# EAGLE design Color_music_board_with_mic (EAGLE 9.0.1)
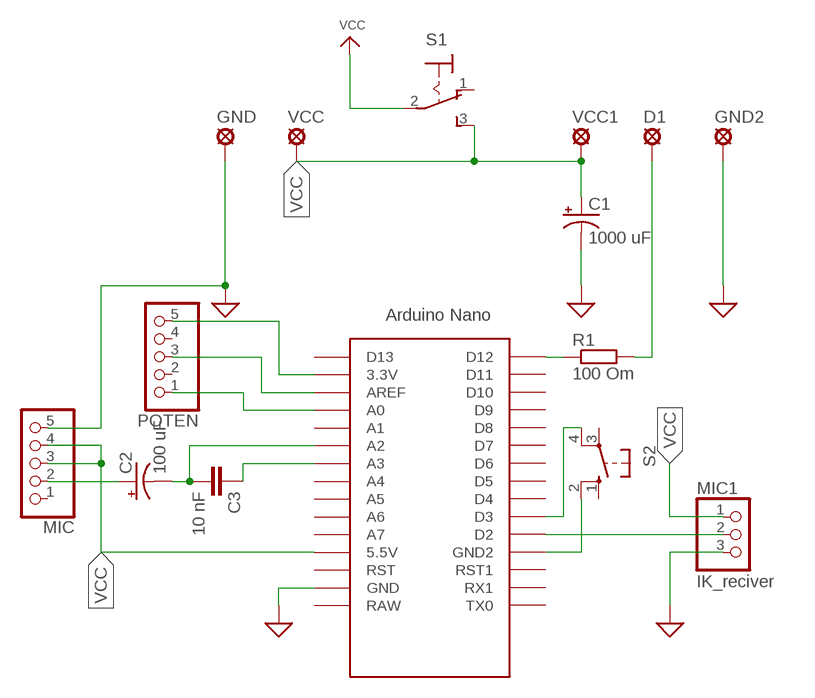
[diagram p0: schematic, sheet 1]

## Parts
C1  1000 uF  CPOL-USTT5D10  [TT5D10]
C2  100 uF  CPOL-USE2.5-6  [E2,5-6]
C3  10 nF  C2.5/2  [C2.5-2]
D1  SE14  [SE14]
GND  SE14  [SE14]
GND2  SE14  [SE14]
MIC  PINHD-1X5  [1X05]
MIC1  IK_reciver  PINHD-1X3  [1X03]
POTEN  PINHD-1X5  [1X05]
R1  100 Om  R-EU_0207/7  [0207/7]
S1  320-916  [320-916]
S2  10-XX  [B3F-10XX]
U$1  NANO  [NANO]
VCC  SE14  [SE14]
VCC1  SE14  [SE14]

## Nets
GND: C1.- GND2.MP GND.MP MIC1.3 MIC.5 U$1.GND ; supply symbol labelled SUP
N$1: D1.MP R1.2
N$2: R1.1 U$1.D12
N$3: C2.+ MIC.2
N$4: MIC1.2 U$1.D2
N$5: C2.- C3.2 U$1.A2
N$6: C3.1 U$1.A3
N$7: POTEN.5 U$1.3.3V
N$8: POTEN.3 U$1.AREF
N$9: POTEN.1 U$1.A0
N$10: S2.2(S1) U$1.GND1(GND2)
N$11: S2.4(P1) U$1.D3
VCC: C1.+ MIC1.1 MIC.3 MIC.4 S1.2(P) S1.3(S) U$1.5V(5.5V) VCC1.MP VCC.MP
Unconnected: MIC.1 POTEN.2 POTEN.4 S1.1(O) S2.1(S) S2.3(P) U$1.A1 U$1.A4 U$1.A5 U$1.A6 U$1.A7 U$1.D4 U$1.D5 U$1.D6 U$1.D7 U$1.D8 U$1.D9 U$1.D10 U$1.D11 U$1.D13 U$1.ICSP1 U$1.ICSP2 U$1.ICSP3 U$1.ICSP4 U$1.ICSP5 U$1.ICSP6 U$1.RAW U$1.RST U$1.RST1 U$1.RX1 U$1.TX0

## Library data of the parts
C1 C2 = rcl:CPOL-US: POLARIZED CAPACITOR, American symbol; SPICEPREFIX: C
C3 = capacitor-wima:C: CAPACITOR naming: grid - package width
D1 GND GND2 VCC VCC1 = solpad:SE14: SOLDER PAD E1553, drill 1,4mm, distributor Buerklin, 07F820
MIC POTEN = pinhead:PINHD-1X5: PIN HEADER
MIC1 = pinhead:PINHD-1X3: PIN HEADER
R1 = resistor:R-EU_: RESISTOR, European symbol
S1 = switch:320-916: TOGGLE SWITCH distributor RS Components
S2 = switch-omron:10-XX: OMRON SWITCH; MPN: B3F-1000; OC_FARNELL: 176432; OC_NEWARK: 36M3542
U$1 = Arduino-clone:NANO: Arduino Nano

## Board
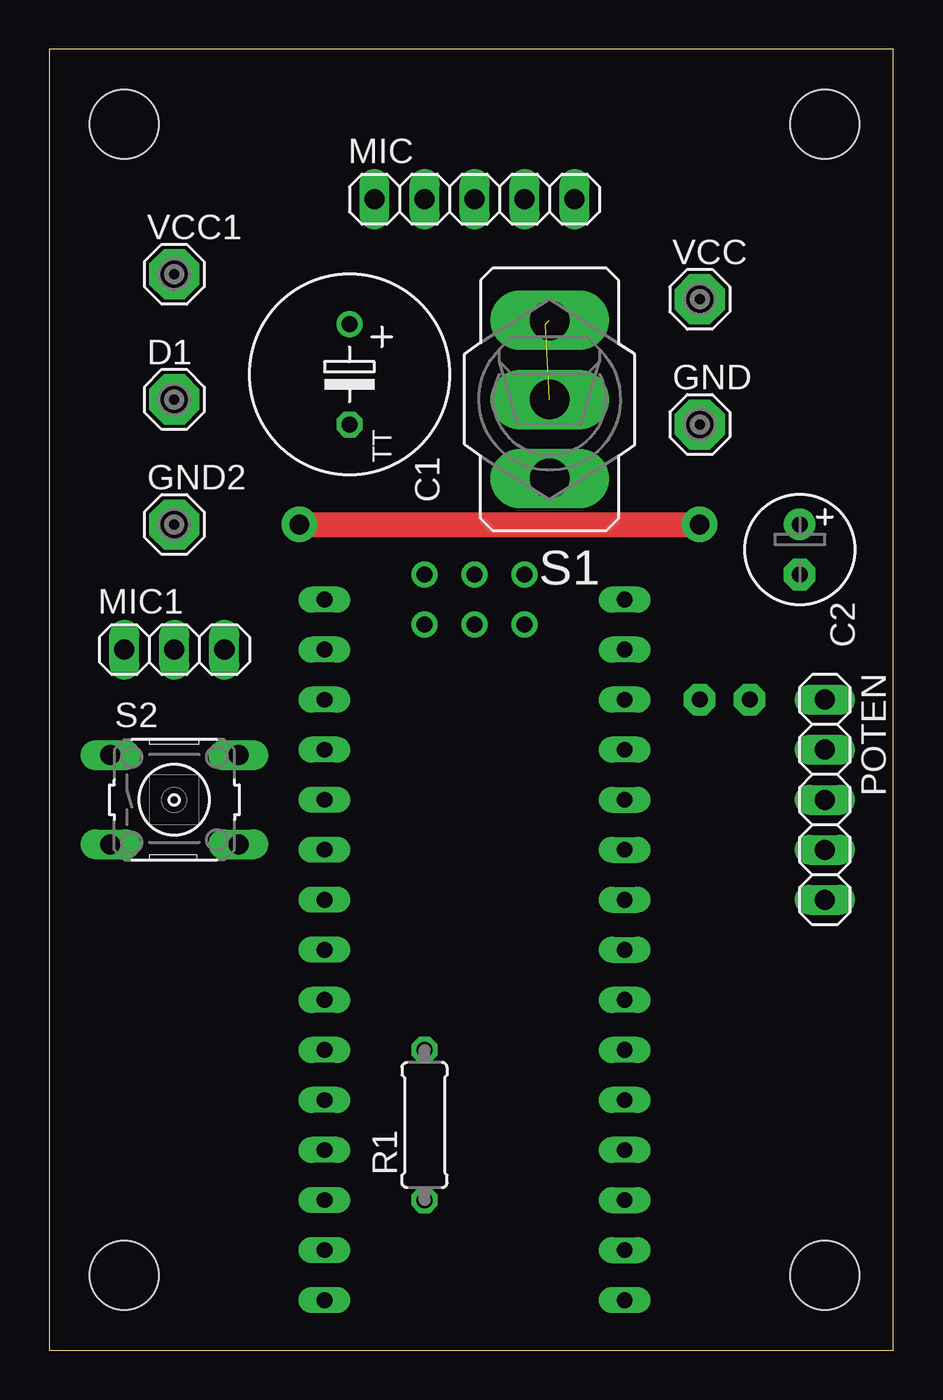
[diagram p1: board, top side]
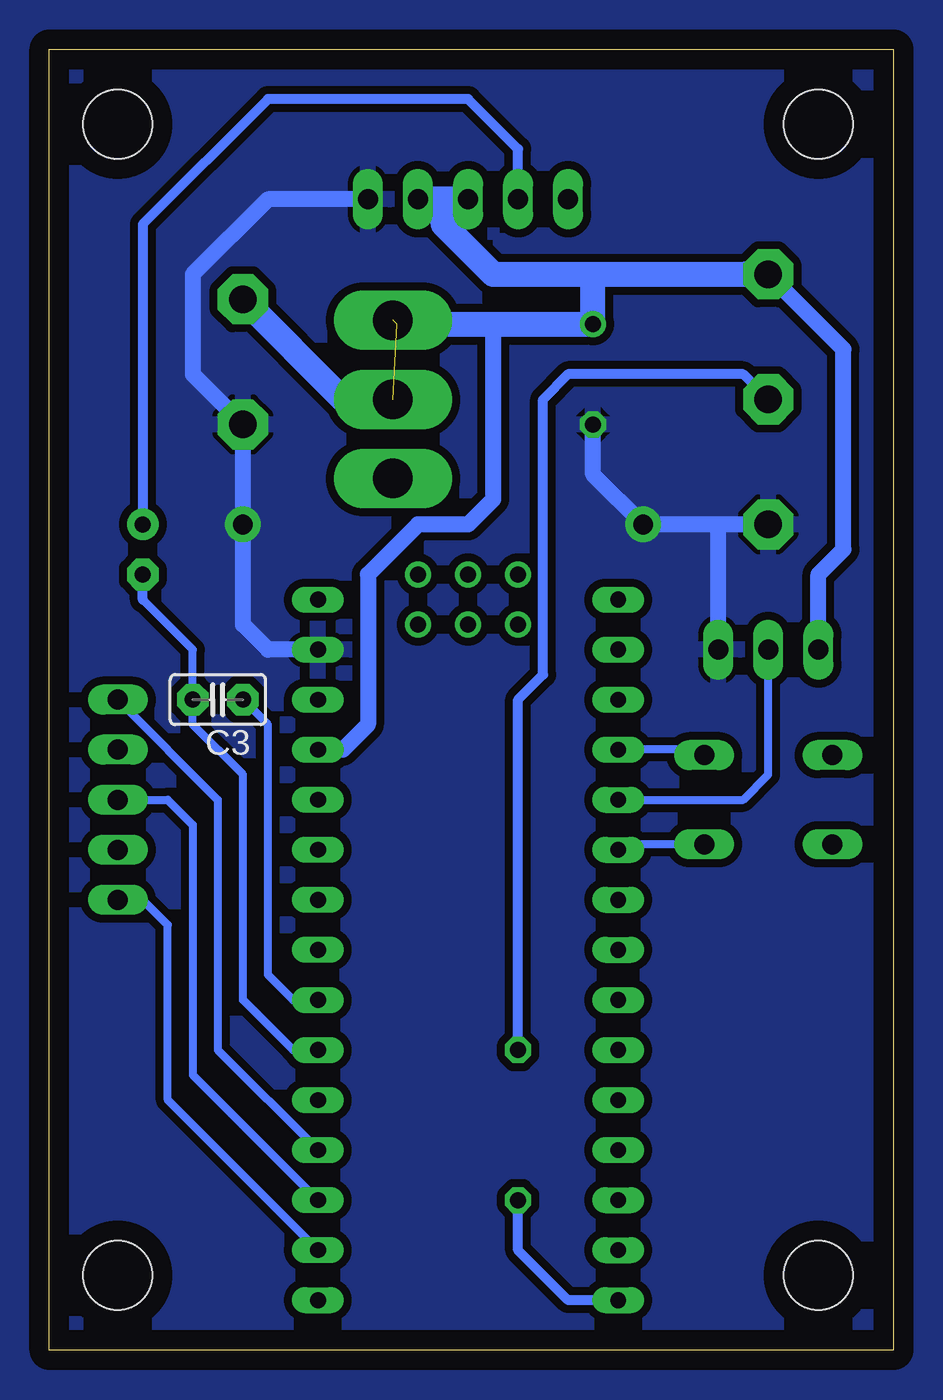
[diagram p2: board, bottom side, seen from below]

Size 42.85 x 66.03 mm. Coordinates in mm from the lower left corner, seen from the top.
Outline: 0,0 42.85,0 42.85,66.03 0,66.03 0,0
Copper layers (1*16): Top 0.035mm / dielectric 1.5mm / Bottom 0.035mm
Design rules "default": minimum track width 6mil, minimum drill 0.35mm, track to track 6mil, track to pad 6mil, pad to pad 6mil, via to via 6mil, smd to smd 6mil, copper to edge 40mil, drill to drill 6mil, minimum pad ring 10mil, minimum via ring 8mil, stop-mask expansion 4mil, vias tented up to drill 0mil, thermal gap 10mil
Holes 3.5 mm at 3.81,3.81 3.81,62.23 39.37,62.23 39.37,3.81
vRestrict: area 3.8,-10.5 to 5.3,-9.9; area 37.9,-10.5 to 39.4,-9.9; area 18.1,-9.8 to 25.1,-8; area -9.2,3.8 to -8.6,5.3; area -9.2,60.7 to -8.6,62.2; area -11.1,29.6 to -9.3,36.5; area 0,72.1 to 1.5,72.7; area 41.4,72.1 to 42.9,72.7; area 18,72.8 to 24.9,74.6; area 51.8,0 to 52.4,1.5; area 51.8,64.5 to 52.4,66; area 49.9,29.6 to 51.7,36.5; 12 lines

### Footprints (pad centres in the part's own frame; a part is rotated, then mirrored left to right if it is on the bottom)
TT5D10 = drill 0.813: + -2.54,0 | drill 0.813 octagon: - 2.54,0
E2,5-6 = drill 0.813 pad 1.6: + -1.27,0 | drill 0.813 pad 1.6 octagon: - 1.27,0
C2.5-2 = drill 0.813 pad 1.6 octagon: 1 -1.27,0; 2 1.27,0
SE14 = drill 1.397 pad 2.54 octagon: MP 0,0
1X05 = drill 1.016 long: 1 -5.08,0; 2 -2.54,0; 3 0,0; 4 2.54,0; 5 5.08,0
1X03 = drill 1.016 long: 1 -2.54,0; 2 0,0; 3 2.54,0
0207/7 = drill 0.813 octagon: 1 -3.81,0; 2 3.81,0
320-916 = drill 2.007 long: 1 0,4.013; 2 0,0; 3 0,-4.013
B3F-10XX = drill 1.016 long: 1 -3.251,2.261; 2 3.251,2.261; 3 -3.251,-2.261; 4 3.251,-2.261
NANO = drill 0.8 long: 3.3V -10.16,24.13; 5V -10.16,-1.27; A0 -10.16,19.05; A1 -10.16,16.51; A2 -10.16,13.97; A3 -10.16,11.43; A4 -10.16,8.89; A5 -10.16,6.35; A6 -10.16,3.81; A7 -10.16,1.27; AREF -10.16,21.59; D2 5.08,1.27; D3 5.08,3.81; D4 5.08,6.35; D5 5.08,8.89; D6 5.08,11.43; D7 5.08,13.97; D8 5.08,16.51; D9 5.08,19.05; D10 5.08,21.59; D11 5.08,24.13; D12 5.08,26.67; D13 -10.16,26.67; GND -10.16,-6.35; GND1 5.08,-1.27; RAW -10.16,-8.89; RST -10.16,-3.81; RST1 5.08,-3.81; RX1 5.08,-6.35; TX0 5.08,-8.89 | drill 0.8: ICSP1 -5.08,-10.16; ICSP2 -5.08,-7.62; ICSP3 -2.54,-10.16; ICSP4 -2.54,-7.62; ICSP5 0,-10.16; ICSP6 0,-7.62

### Placement (x,y rotation side)
C1  15.24,49.53 270 top
C2  38.1,40.64 270 top
C3  34.29,33.02 180 bottom
D1  6.35,48.26 0 top
GND  33.02,46.99 0 top
GND2  6.35,41.91 0 top
MIC  21.59,58.42 0 top
MIC1  6.35,35.56 0 top
POTEN  39.37,27.94 270 top
R1  19.05,11.43 90 top
S1  25.4,48.26 180 top
S2  6.35,27.94 0 top
U$1  19.05,29.21 180 top
VCC  33.02,53.34 0 top
VCC1  6.35,54.61 0 top

### Tracks (layer width: path | path; a pad name or v marks a point on that pad's centre or on a via)
GND  (via drill 1 pad 1.8)
  Top 1.27: v12.7,41.91 v33.02,41.91
  Bottom 0.152: 32.92,47.09 GND.MP
  Bottom 0.813: C1.- 15.24,44.45 v12.7,41.91 8.89,41.91 | MIC.5 31.75,58.42 35.56,54.61 35.56,49.53 GND.MP v33.02,41.91 33.02,36.83 31.75,35.56 U$1.GND | GND2.MP 8.89,41.91 | MIC1.3 8.89,41.91
  pour Bottom (isolate 0.406): -3.81,-3.81 -3.81,68.58 46.99,68.58 46.99,-3.81
N$1
  Bottom 0.508: D1.MP 7.62,49.53 16.51,49.53 17.78,48.26 17.78,34.29 19.05,33.02 R1.2
N$2
  Bottom 0.508: U$1.D12 16.51,2.54 19.05,5.08 R1.1
N$3
  Bottom 0.508: MIC.2 19.05,60.96 21.59,63.5 31.75,63.5 38.1,57.15 C2.+
N$4
  Bottom 0.406: U$1.D2 7.62,27.94 6.35,29.21 MIC1.2
N$5
  Bottom 0.406: 38.1,38.1 35.56,35.56 C3.2 35.56,31.75 33.02,29.21 33.02,17.78 30.48,15.24 U$1.A2
  Bottom 0.508: 38.1,38.1 C2.-
N$6
  Bottom 0.406: U$1.A3 30.48,17.78 31.75,19.05 31.75,31.75 C3.1
N$7
  Bottom 0.406: U$1.3.3V 36.83,12.7 36.83,21.59 38.1,22.86 POTEN.5
N$8
  Bottom 0.406: U$1.AREF 35.56,13.97 35.56,26.67 36.83,27.94 POTEN.3
N$9
  Bottom 0.406: U$1.A0 34.29,15.24 34.29,27.94 POTEN.1
N$10
  Bottom 0.406: S2.2 9.88,30.48 U$1.GND1
N$11
  Bottom 0.406: S2.4 13.69,25.68 U$1.D3
VCC  (2 unrouted)
  Bottom 0.813: U$1.5V 27.94,30.48 26.67,31.75 26.67,39.37 24.13,41.91 21.59,41.91 20.32,43.18 20.32,52.07 | VCC1.MP 2.54,50.8 2.54,40.64 3.81,39.37 MIC1.1
  Bottom 1.27: 7.62,54.61 VCC1.MP 15.24,54.61 | MIC.3 22.86,58.42 | 22.86,58.42 MIC.4 | 22.86,58.42 22.86,57.15 20.32,54.61 15.24,54.61 | 15.24,54.61 C1.+ 20.32,52.07 25.2,52.07 | S1.2 27.94,48.26 VCC.MP